# Altium schematic sheet Block Diagram.SchDoc
size A4; SheetNumber: 1; SheetTotal: 2
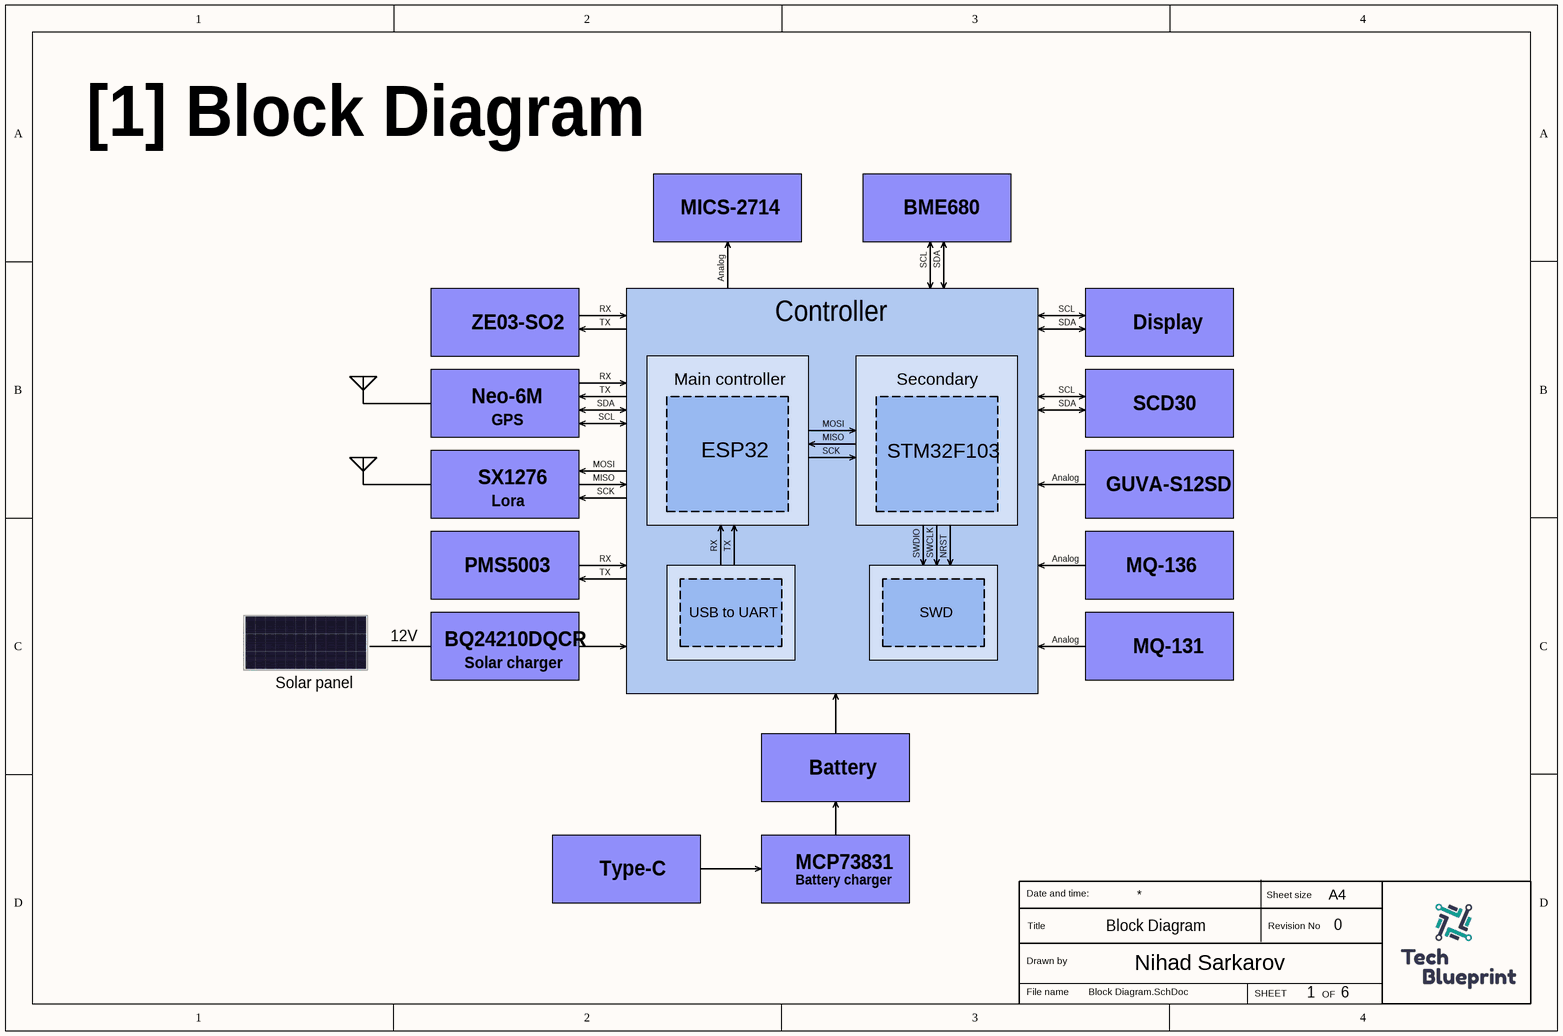
[diagram p0: Block Diagram.SchDoc]

## Notes on the sheet
- [1] Block Diagram
- MICS-2714
- BME680
- RX
- Analog
- SCL
- SDA
- ZE03-SO2
- TX
- Main controller
- Controller
- Secondary
- Display
- Neo-6M
- GPS
- MOSI
- MISO
- SCD30
- SX1276
- Lora
- SCK
- ESP32
- STM32F103
- GUVA-S12SD
- PMS5003
- SWDIO
- SWCLK
- NRST
- MQ-136
- 12V
- BQ24210DQCR
- USB to UART
- SWD
- MQ-131
- Solar panel
- Solar charger
- Battery
- Type-C
- MCP73831
- Battery charger
- Block Diagram
- 0
- 1
- 6
- Date and time:
- Title
- Sheet size
- Revision No
- A4
- Drawn by
- File name
- Nihad Sarkarov
- SHEET
- OF